# EAGLE schematic caretaker-remotecontrol (EAGLE 6.5.0)
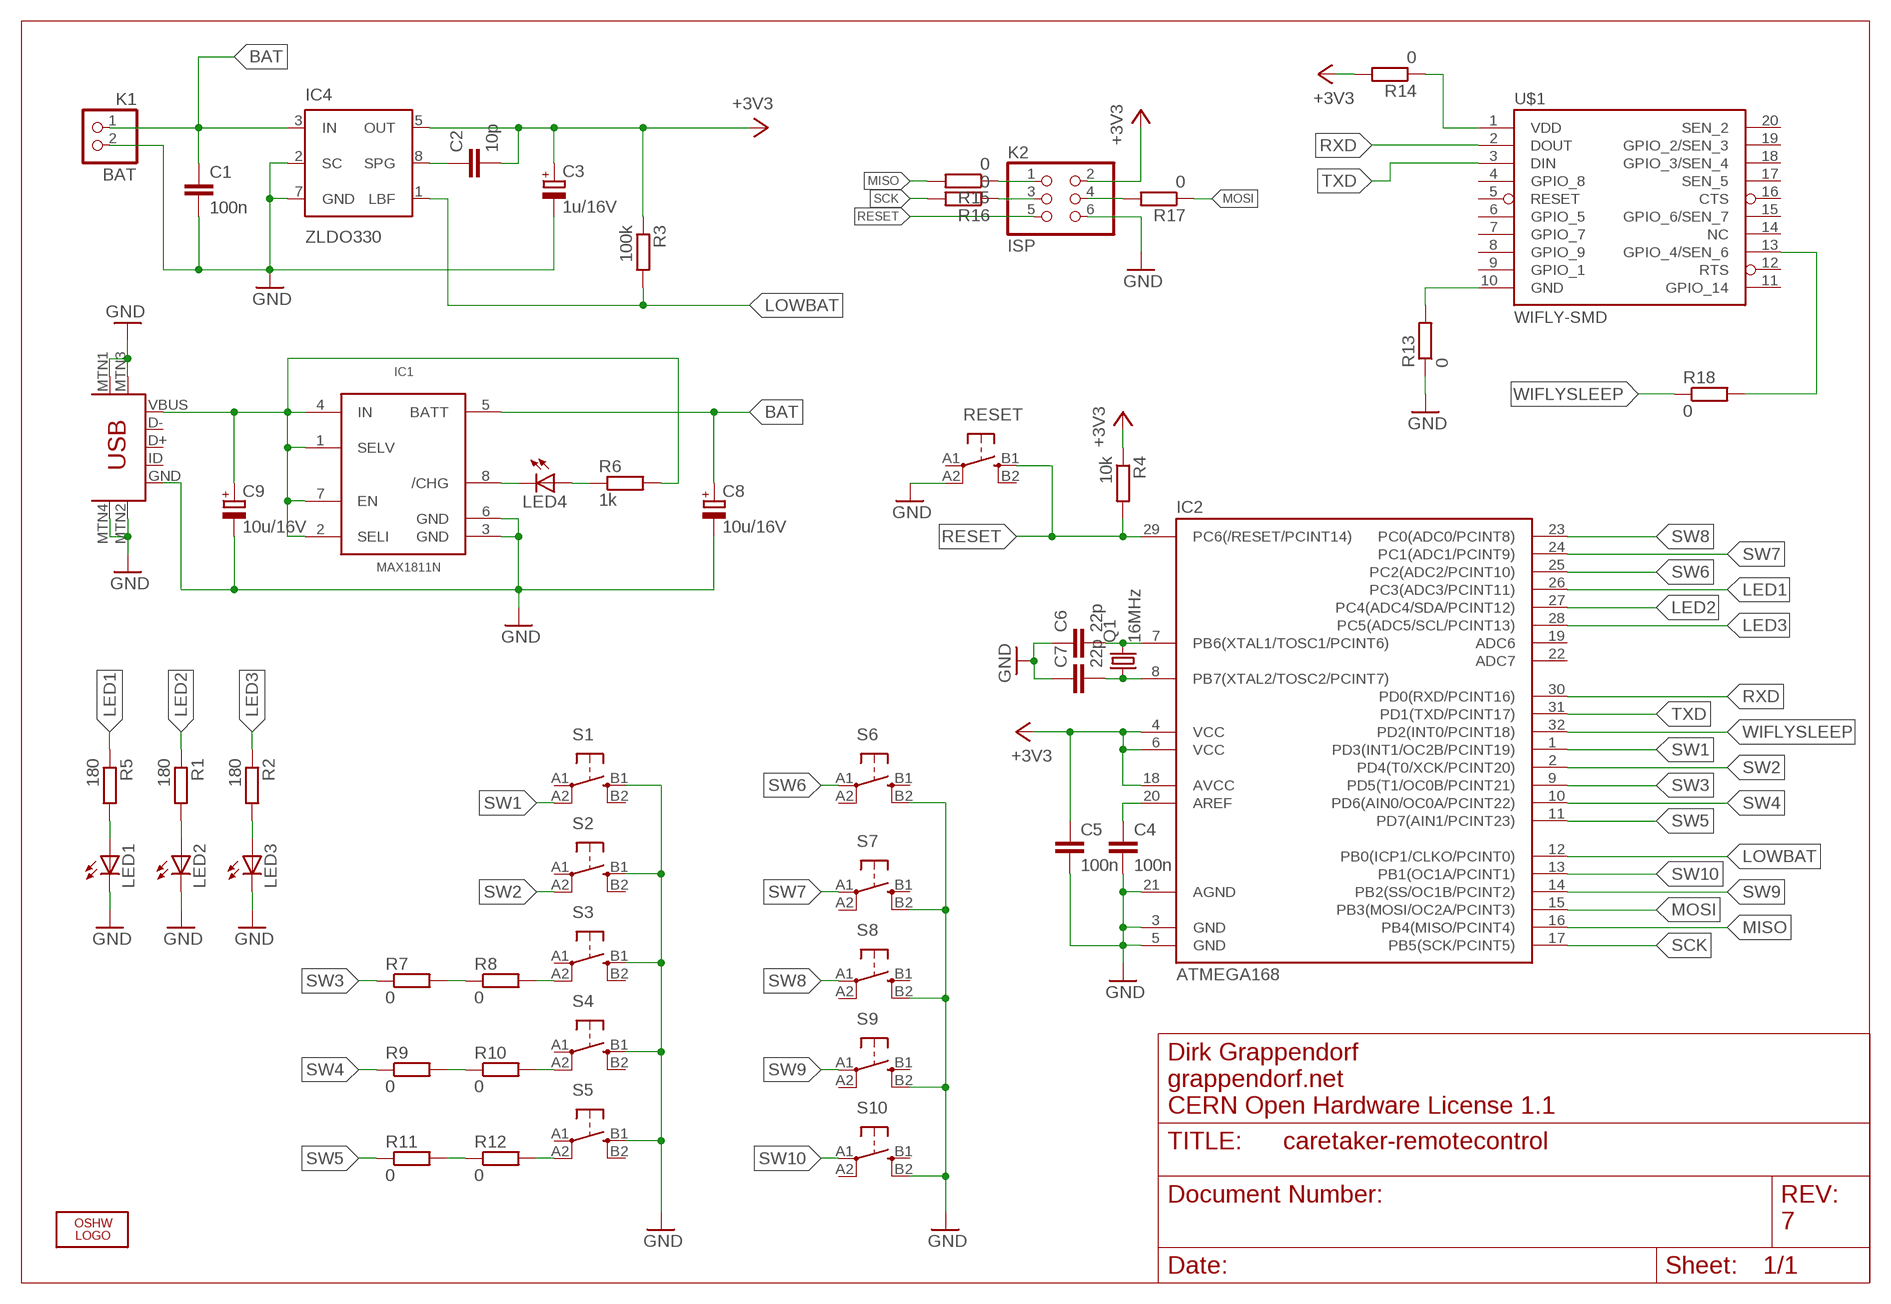
[diagram p0: schematic, sheet 1]

## Parts
C1  100n  C-EUC1206  [C1206]
C2  10p  C-EUC1206  [C1206]
C3  1u/16V  CPOL-EUB  [PANASONIC_B]
C4  100n  C-EUC1206  [C1206]
C5  100n  C-EUC1206  [C1206]
C6  22p  C-EUC1206  [C1206]
C7  22p  C-EUC1206  [C1206]
C8  10u/16V  CPOL-EUB  [PANASONIC_B]
C9  10u/16V  CPOL-EUB  [PANASONIC_B]
IC1  MAX1811N  [SO08]
IC2  ATMEGA168  ATMEGA48/88/168-AU  [TQFP32-08]
IC4  ZLDO330  [SM8]
K1  BAT  PINHD-1X2  [1X02]
K2  ISP  PINHD-2X3/90  [2X03/90]
K3  USB-MINIB-5PIN  [USB-MINIB]
LED1  LEDKA-3528ASYC  [KA-3528ASYC]
LED2  LEDKA-3528ASYC  [KA-3528ASYC]
LED3  LEDKA-3528ASYC  [KA-3528ASYC]
LED4  LEDKA-3528ASYC  [KA-3528ASYC]
LOGO1  OSHW_LOGO_10MILX0350-NT  [OSHW_10X350_NOTEXT]
Q1  16MHz  CRYSTALHC49UP  [HC49UP]
R1  180  R-EU_R1206  [R1206]
R2  180  R-EU_R1206  [R1206]
R3  100k  R-EU_R1206  [R1206]
R4  10k  R-EU_R1206  [R1206]
R5  180  R-EU_R1206  [R1206]
R6  1k  R-EU_R1206  [R1206]
R7  0  R-EU_R1206  [R1206]
R8  0  R-EU_R1206  [R1206]
R9  0  R-EU_R1206  [R1206]
R10  0  R-EU_R1206  [R1206]
R11  0  R-EU_R1206  [R1206]
R12  0  R-EU_R1206  [R1206]
R13  0  R-EU_R1206  [R1206]
R14  0  R-EU_R1206  [R1206]
R15  0  R-EU_R1206  [R1206]
R16  0  R-EU_R1206  [R1206]
R17  0  R-EU_R1206  [R1206]
R18  0  R-EU_R1206  [R1206]
RESET  TAC_SWITCHSMD-BIG  [TACTILE_SWITCH_TALL]
S1  TAC_SWITCHSMD-BIG  [TACTILE_SWITCH_TALL]
S2  TAC_SWITCHSMD-BIG  [TACTILE_SWITCH_TALL]
S3  TAC_SWITCHSMD-BIG  [TACTILE_SWITCH_TALL]
S4  TAC_SWITCHSMD-BIG  [TACTILE_SWITCH_TALL]
S5  TAC_SWITCHSMD-BIG  [TACTILE_SWITCH_TALL]
S6  TAC_SWITCHSMD-BIG  [TACTILE_SWITCH_TALL]
S7  TAC_SWITCHSMD-BIG  [TACTILE_SWITCH_TALL]
S8  TAC_SWITCHSMD-BIG  [TACTILE_SWITCH_TALL]
S9  TAC_SWITCHSMD-BIG  [TACTILE_SWITCH_TALL]
S10  TAC_SWITCHSMD-BIG  [TACTILE_SWITCH_TALL]
U$1  WIFLY-SMD  [WIFLY-SMD]

## Nets
+3V3: C2.2 C3.+ C5.1 IC2.4(VCC) IC2.6(VCC) IC2.18(AVCC) IC4.5(OUT) K2.2 R3.1 R4.1 R14.2
BAT: C1.1 C8.+ IC1.5(BATT) IC4.3(IN) K1.1
GND: C1.2 C3.- C4.2 C5.2 C6.1 C7.1 C8.- C9.- IC1.3(GND) IC1.6(GND) IC2.3(GND) IC2.5(GND) IC2.21(AGND) IC4.2(SC) IC4.7(GND) K1.2 K2.6 K3.GND K3.MTN1(MTN2) K3.MTN2(MTN3) K3.MTN3(MTN1) K3.MTN4 LED1.C LED2.C LED3.C R13.1 RESET.A2 S1.B1 S2.B1 S3.B1 S4.B1 S5.B1 S6.B2 S7.B2 S8.B2 S9.B2 S10.B2
LED1: IC2.26(PC3(ADC3/PCINT11)) R5.1
LED2: IC2.27(PC4(ADC4/SDA/PCINT12)) R1.1
LED3: IC2.28(PC5(ADC5/SCL/PCINT13)) R2.1
LOWBAT: IC2.12(PB0(ICP1/CLKO/PCINT0)) IC4.1(LBF) R3.2
MISO: IC2.16(PB4(MISO/PCINT4)) R15.2
MOSI: IC2.15(PB3(MOSI/OC2A/PCINT3)) R17.1
N$1: C9.+ IC1.1(SELV) IC1.2(SELI) IC1.4(IN) IC1.7(EN) K3.VBUS R6.2
N$2: C4.1 IC2.20(AREF)
N$3: C6.2 IC2.7(PB6(XTAL1/TOSC1/PCINT6)) Q1.2
N$4: C7.2 IC2.8(PB7(XTAL2/TOSC2/PCINT7)) Q1.1
N$6: LED2.A R1.2
N$7: LED3.A R2.2
N$9: LED4.A R6.1
N$10: LED1.A R5.2
N$12: IC1.8(/CHG) LED4.C
N$15: C2.1 IC4.8(SPG)
N$16: R8.2 S3.A2
N$17: R10.2 S4.A2
N$18: R12.2 S5.A2
N$19: R7.2 R8.1
N$20: R9.2 R10.1
N$21: R11.2 R12.1
N$22: R13.2 U$1.10(GND)
N$23: R14.1 U$1.1(VDD)
N$24: K2.1 R15.1
N$25: K2.3 R16.1
N$26: K2.4 R17.2
N$27: R18.2 U$1.13(GPIO_4/SEN_6)
RESET: IC2.29(PC6(/RESET/PCINT14)) K2.5 R4.2 RESET.B1
RXD: IC2.30(PD0(RXD/PCINT16)) U$1.2(DOUT)
SCK: IC2.17(PB5(SCK/PCINT5)) R16.2
SW1: IC2.1(PD3(INT1/OC2B/PCINT19)) S1.A2
SW2: IC2.2(PD4(T0/XCK/PCINT20)) S2.A2
SW3: IC2.9(PD5(T1/OC0B/PCINT21)) R7.1
SW4: IC2.10(PD6(AIN0/OC0A/PCINT22)) R9.1
SW5: IC2.11(PD7(AIN1/PCINT23)) R11.1
SW6: IC2.25(PC2(ADC2/PCINT10)) S6.A1
SW7: IC2.24(PC1(ADC1/PCINT9)) S7.A1
SW8: IC2.23(PC0(ADC0/PCINT8)) S8.A1
SW9: IC2.14(PB2(SS/OC1B/PCINT2)) S9.A1
SW10: IC2.13(PB1(OC1A/PCINT1)) S10.A1
TXD: IC2.31(PD1(TXD/PCINT17)) U$1.3(DIN)
WIFLYSLEEP: IC2.32(PD2(INT0/PCINT18)) R18.1
Unconnected: IC2.19(ADC6) IC2.22(ADC7) K3.D+ K3.D- K3.ID RESET.A1 RESET.B2 S1.A1 S1.B2 S2.A1 S2.B2 S3.A1 S3.B2 S4.A1 S4.B2 S5.A1 S5.B2 S6.A2 S6.B1 S7.A2 S7.B1 S8.A2 S8.B1 S9.A2 S9.B1 S10.A2 S10.B1 U$1.4(GPIO_8) U$1.5(RESET) U$1.6(GPIO_5) U$1.7(GPIO_7) U$1.8(GPIO_9) U$1.9(GPIO_1) U$1.11(GPIO_14) U$1.12(RTS) U$1.14(NC) U$1.15(GPIO_6/SEN_7) U$1.16(CTS) U$1.17(SEN_5) U$1.18(GPIO_3/SEN_4) U$1.19(GPIO_2/SEN_3) U$1.20(SEN_2)

## Notes on the sheet
- Dirk Grappendorf
- grappendorf.net
- CERN Open Hardware License 1.1
- 7

## Library data of the parts
C1 C2 C4-C7 = rcl:C-EU: CAPACITOR, European symbol
C3 C8 C9 = rcl:CPOL-EU: POLARIZED CAPACITOR, European symbol
IC1 = grapelabs:MAX1811
IC2 = atmega8:ATMEGA48/88/168
IC4 = grapelabs:ZLDO330
K1 = pinhead:PINHD-1X2: PIN HEADER
K2 = pinhead:PINHD-2X3: PIN HEADER
K3 = SparkFun:USB-MINIB: Mini-USB "B" connector with 5th pin broken out. Created new symbol breaking out 5th "ID" pin in mini/micro USB connector spec. See: http://en.wikipedia.org/wiki/Mini_usb#Cables. Uses same footprint as 4-pin symbol. Also added pins to connect to mounting / shield pads if required (probably not generally needed as signals aren't shielded once they leave the connector).
LED1-LED4 = led:LED: LED OSRAM: - CHIPLED LG R971, LG N971, LY N971, LG Q971, LY Q971, LO R971, LY R971 LH N974, LH R974 LS Q976, LO Q976, LY Q976 LO Q996 - Hyper CHIPLED LW Q18S LB Q993, LB Q99A, LB R99A - SideLED LS A670, LO A670, LY A670, LG A670, LP A670 LB A673, LV A673, LT A673, LW A673 LH A674 LY A675 LS A676, LA A676, LO A676, LY A676, LW A676 LS A679, LY A679, LG A679 - Hyper Micro SIDELED® LS Y876, LA Y876, LO Y876, LY Y876 LT Y87S - SmartLED LW L88C, LW L88S LB L89C, LB L89S, LG L890 LS L89K, LO L89K, LY L89K LS L896, LA L896, LO L896, LY L896 - TOPLED LS T670, LO T670, LY T670, LG T670, LP T670 LSG T670, LSP T670, LSY T670, LOP T670, LYG T670 LG T671, LOG T671, LSG T671 LB T673, LV T673, LT T673, LW T673 LH T674 LS T676, LA T676, LO T676, LY T676, LB T676, LH T676, LSB T676, LW T676 LB T67C, LV T67C, LT T67C, LS T67K, LO T67K, LY T67K, LW E67C LS E67B, LA E67B, LO E67B, LY E67B, LB E67C, LV E67C, LT E67C LW T67C LS T679, LY T679, LG T679 LS T770, LO T770, LY T770, LG T770, LP T770 LB T773, LV T773, LT T773, LW T773 LH T774 LS E675, LA E675, LY E675, LS T675 LS T776, LA T776, LO T776, LY T776, LB T776 LHGB T686 LT T68C, LB T68C - Hyper Mini TOPLED® LB M676 - Mini TOPLED Santana® LG M470 LS M47K, LO M47K, LY M47K Source: http://www.osram.convergy.de LUXEON: - LUMILED® LXK2-PW12-R00, LXK2-PW12-S00, LXK2-PW14-U00, LXK2-PW14-V00 LXK2-PM12-R00, LXK2-PM12-S00, LXK2-PM14-U00 LXK2-PE12-Q00, LXK2-PE12-R00, LXK2-PE12-S00, LXK2-PE14-T00, LXK2-PE14-U00 LXK2-PB12-K00, LXK2-PB12-L00, LXK2-PB12-M00, LXK2-PB14-N00, LXK2-PB14-P00, LXK2-PB14-Q00 LXK2-PR12-L00, LXK2-PR12-M00, LXK2-PR14-Q00, LXK2-PR14-R00 LXK2-PD12-Q00, LXK2-PD12-R00, LXK2-PD12-S00 LXK2-PH12-R00, LXK2-PH12-S00 LXK2-PL12-P00, LXK2-PL12-Q00, LXK2-PL12-R00 Source: www.luxeon.com KINGBRIGHT: KA-3528ASYC Source: www.kingbright.com
LOGO1 = OSHW:OSHW_LOGO_10MIL
Q1 = crystal:CRYSTAL: CRYSTAL
R1-R18 = rcl:R-EU_: RESISTOR, European symbol
RESET S1-S10 = grapelabs-switches:TAC_SWITCH: Momentary Switch Button commonly used for reset or general input. Spark Fun Electronics SKU : COM-00097
U$1 = grapelabs:WIFLY